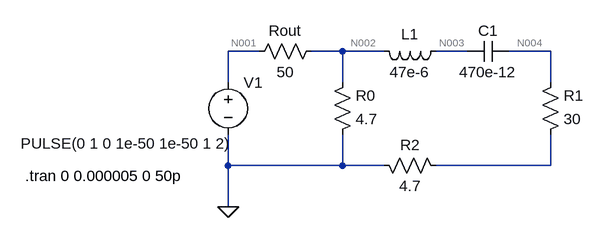
[diagram p0: schematic (1)(a)step.asc]
(1)(a)step.asc, the LTspice schematic file:
Version 4
SHEET 1 880 680
WIRE 176 -96 128 -96
WIRE 304 -96 256 -96
WIRE 368 -96 304 -96
WIRE 496 -96 448 -96
WIRE 624 -96 560 -96
WIRE 128 -48 128 -96
WIRE 304 -48 304 -96
WIRE 624 -48 624 -96
WIRE 128 80 128 32
WIRE 304 80 304 32
WIRE 304 80 128 80
WIRE 368 80 304 80
WIRE 624 80 624 32
WIRE 624 80 448 80
WIRE 128 144 128 80
FLAG 128 144 0
SYMBOL res 272 -112 R90
WINDOW 0 0 56 VBottom 2
WINDOW 3 32 56 VTop 2
SYMATTR InstName Rout
SYMATTR Value 50
SYMBOL res 288 48 M180
WINDOW 0 36 76 Left 2
WINDOW 3 36 40 Left 2
SYMATTR InstName R0
SYMATTR Value 4.7
SYMBOL res 352 64 M90
WINDOW 0 0 56 VBottom 2
WINDOW 3 32 56 VTop 2
SYMATTR InstName R2
SYMATTR Value 4.7
SYMBOL res 608 48 M180
WINDOW 0 36 76 Left 2
WINDOW 3 36 40 Left 2
SYMATTR InstName R1
SYMATTR Value 30
SYMBOL cap 560 -112 R90
WINDOW 0 0 32 VBottom 2
WINDOW 3 32 32 VTop 2
SYMATTR InstName C1
SYMATTR Value 470e-12
SYMBOL ind 464 -112 R90
WINDOW 0 5 56 VBottom 2
WINDOW 3 32 56 VTop 2
SYMATTR InstName L1
SYMATTR Value 47e-6
SYMBOL voltage 128 -64 R0
WINDOW 123 24 124 Left 2
WINDOW 39 0 0 Left 2
WINDOW 3 -319 110 Left 2
SYMATTR Value PULSE(0 1 0 1e-50 1e-50 1 2)
SYMATTR InstName V1
TEXT -184 96 Left 2 !.tran 0 0.000005 0 50p

The netlist it stands for:
* (1)(a)step.asc
Rout N002 N001 50
R0 0 N002 4.7
R2 0 N005 4.7
R1 N005 N004 30
C1 N004 N003 470e-12
L1 N003 N002 47e-6
V1 N001 0 PULSE(0 1 0 1e-50 1e-50 1 2)
.tran 0 0.000005 0 50p
.backanno
.end

* Results of the author's LTspice run, read from the files saved beside the schematic
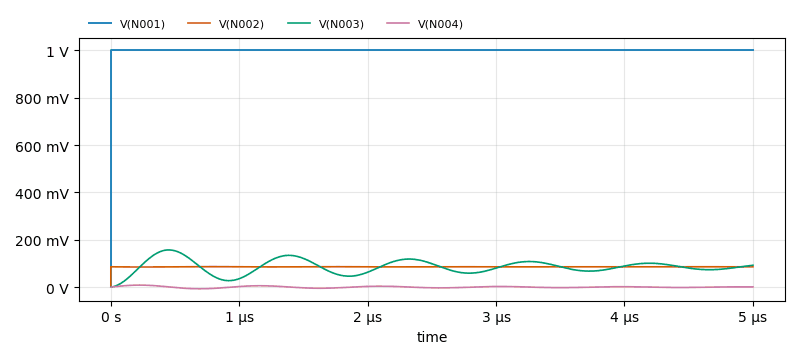
[diagram p1: Transient Analysis of (1)(a)step.asc, plotted from the saved traces]
* Transient Analysis, 1 run:
*   V(N001): min 0 V, max 1 V, average 1 V, rms 1 V, last 1 V
*   V(N002): min 0 V, max 86.8 mV, average 85.89 mV, rms 85.89 mV, last 85.8 mV
*   V(N003): min 0 V, max 157.1 mV, average 85.62 mV, rms 90.59 mV, last 92.37 mV
*   V(N004): min -7.072 mV, max 8.589 mV, average 297.9 µV, rms 3.248 mV, last 985.8 µV